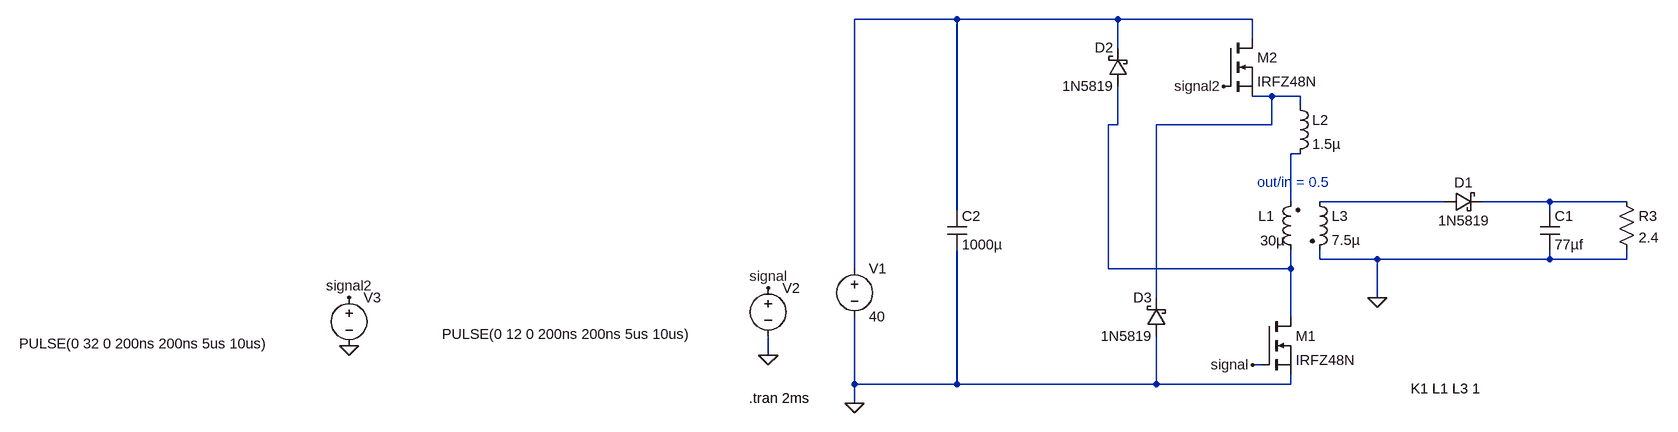
[diagram p0: schematic flyback_circuit_two_switch.asc]
flyback_circuit_two_switch.asc, the LTspice schematic file:
Version 4
SHEET 1 2028 680
WIRE 240 -304 64 -304
WIRE 1120 -304 240 -304
WIRE 1344 -304 1120 -304
WIRE 1344 -272 1344 -304
WIRE 1120 -256 1120 -304
WIRE 1376 -176 1344 -176
WIRE 1424 -176 1376 -176
WIRE 1424 -160 1424 -176
WIRE 1120 -128 1120 -192
WIRE 1120 -128 1104 -128
WIRE 1376 -128 1376 -176
WIRE 1376 -128 1184 -128
WIRE 1424 -80 1408 -80
WIRE 1408 0 1408 -80
WIRE 1664 0 1456 0
WIRE 1840 0 1728 0
WIRE 1968 0 1840 0
WIRE 240 16 240 -304
WIRE 1840 16 1840 0
WIRE 1456 96 1456 80
WIRE 1552 96 1456 96
WIRE 1840 96 1840 80
WIRE 1840 96 1552 96
WIRE 1968 96 1968 80
WIRE 1968 96 1840 96
WIRE 64 112 64 -304
WIRE 1104 112 1104 -128
WIRE 1408 112 1408 80
WIRE 1408 112 1104 112
WIRE 1184 160 1184 -128
WIRE 1552 160 1552 96
WIRE 1408 192 1408 112
WIRE -80 256 -80 224
WIRE 1360 272 1344 272
WIRE 64 304 64 192
WIRE 240 304 240 80
WIRE 240 304 64 304
WIRE 1184 304 1184 224
WIRE 1184 304 240 304
WIRE 1408 304 1408 288
WIRE 1408 304 1184 304
WIRE 64 336 64 304
FLAG 64 336 0
FLAG -80 256 0
FLAG -80 144 signal
FLAG 1344 272 signal
FLAG 1552 160 0
FLAG -832 240 0
FLAG -832 160 signal2
FLAG 1296 -192 signal2
SYMBOL voltage 64 96 R0
WINDOW 123 0 0 Left 0
WINDOW 39 0 0 Left 0
SYMATTR InstName V1
SYMATTR Value 40
SYMBOL nmos 1360 192 R0
SYMATTR InstName M1
SYMATTR Value IRFZ48N
SYMBOL ind2 1424 96 R180
WINDOW 0 43 72 Left 2
WINDOW 3 26 31 Left 2
SYMATTR InstName L1
SYMATTR Value 30µ
SYMATTR Type ind
SYMATTR SpiceLine2 IC=0
SYMBOL ind2 1440 -16 R0
SYMATTR InstName L3
SYMATTR Value 7.5µ
SYMATTR Type ind
SYMBOL voltage -80 128 R0
WINDOW 3 -565 93 Left 2
WINDOW 123 0 0 Left 0
WINDOW 39 0 0 Left 0
SYMATTR Value PULSE(0 12 0 200ns 200ns 5us 10us)
SYMATTR InstName V2
SYMBOL cap 1824 16 R0
SYMATTR InstName C1
SYMATTR Value 77µf
SYMATTR SpiceLine2 IC=12
SYMBOL res 1952 -16 R0
SYMATTR InstName R3
SYMATTR Value 2.4
SYMBOL schottky 1664 16 R270
WINDOW 0 32 32 VTop 2
WINDOW 3 0 32 VBottom 2
SYMATTR InstName D1
SYMATTR Value 1N5819
SYMATTR Description Diode
SYMATTR Type diode
SYMBOL nmos 1296 -272 R0
SYMATTR InstName M2
SYMATTR Value IRFZ48N
SYMBOL voltage -832 144 R0
WINDOW 3 -565 93 Left 2
WINDOW 123 0 0 Left 0
WINDOW 39 0 0 Left 0
SYMATTR Value PULSE(0 32 0 200ns 200ns 5us 10us)
SYMATTR InstName V3
SYMBOL schottky 1136 -192 R180
WINDOW 0 24 64 Left 2
WINDOW 3 24 0 Left 2
SYMATTR InstName D2
SYMATTR Value 1N5819
SYMATTR Description Diode
SYMATTR Type diode
SYMBOL cap 224 16 R0
SYMATTR InstName C2
SYMATTR Value 1000µ
SYMBOL schottky 1200 224 R180
WINDOW 0 24 64 Left 2
WINDOW 3 24 0 Left 2
SYMATTR InstName D3
SYMATTR Value 1N5819
SYMATTR Description Diode
SYMATTR Type diode
SYMBOL ind 1408 -176 R0
SYMATTR InstName L2
SYMATTR Value 1.5µ
TEXT 1352 -32 Left 2 ;out/in = 0.5
TEXT -112 328 Left 2 !.tran 2ms
TEXT 1608 312 Left 2 !K1 L1 L3 1

The netlist it stands for:
* flyback_circuit_two_switch.asc
V1 N001 0 40
M1 N003 signal 0 0 IRFZ48N
L1 N003 N004 30µ IC=0
L3 N005 0 7.5µ
V2 signal 0 PULSE(0 12 0 200ns 200ns 5us 10us)
C1 N006 0 77µf IC=12
R3 N006 0 2.4
D1 N005 N006 1N5819
M2 N001 signal2 N002 N002 IRFZ48N
V3 signal2 0 PULSE(0 32 0 200ns 200ns 5us 10us)
D2 N003 N001 1N5819
C2 N001 0 1000µ
D3 0 N002 1N5819
L2 N002 N004 1.5µ
.model D D
.lib standard.dio
.model NMOS NMOS
.model PMOS PMOS
.lib standard.mos
* out/in = 0.5
.tran 2ms
K1 L1 L3 1
.backanno
.end